# EAGLE design wsd_raspi_shield (EAGLE 6.6.0)
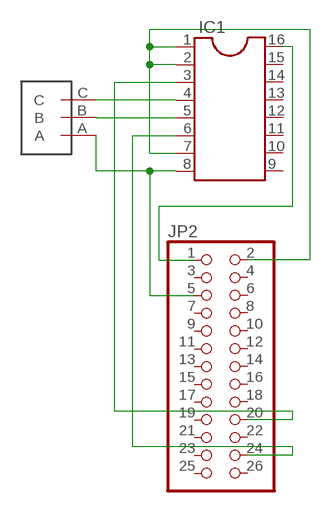
[diagram p0: schematic, sheet 1]

## Parts
IC1  DIL16  [DIL16]
JP2  PINHD-2X13  [2X13]
U$1  TERMINALBLOCK_3P_3.5MM  [TERMINALBLOCK_3P_3.5MM]

## Nets
N$1: IC1.8 JP2.5 U$1.A
N$2: IC1.16 JP2.1
N$3: IC1.3 JP2.20
N$4: IC1.1 IC1.2 IC1.7 JP2.2
N$5: IC1.6 JP2.24
N$6: IC1.5 U$1.B
N$7: IC1.4 U$1.C
Unconnected: IC1.9 IC1.10 IC1.11 IC1.12 IC1.13 IC1.14 IC1.15 JP2.3 JP2.4 JP2.6 JP2.7 JP2.8 JP2.9 JP2.10 JP2.11 JP2.12 JP2.13 JP2.14 JP2.15 JP2.16 JP2.17 JP2.18 JP2.19 JP2.21 JP2.22 JP2.23 JP2.25 JP2.26

## Library data of the parts
IC1 = ic-package:DIL16: Dual In Line / Socket
JP2 = pinhead:PINHD-2X13: PIN HEADER
U$1 = Terminalblock:TERMINALBLOCK_3P_3.5MM

## Board
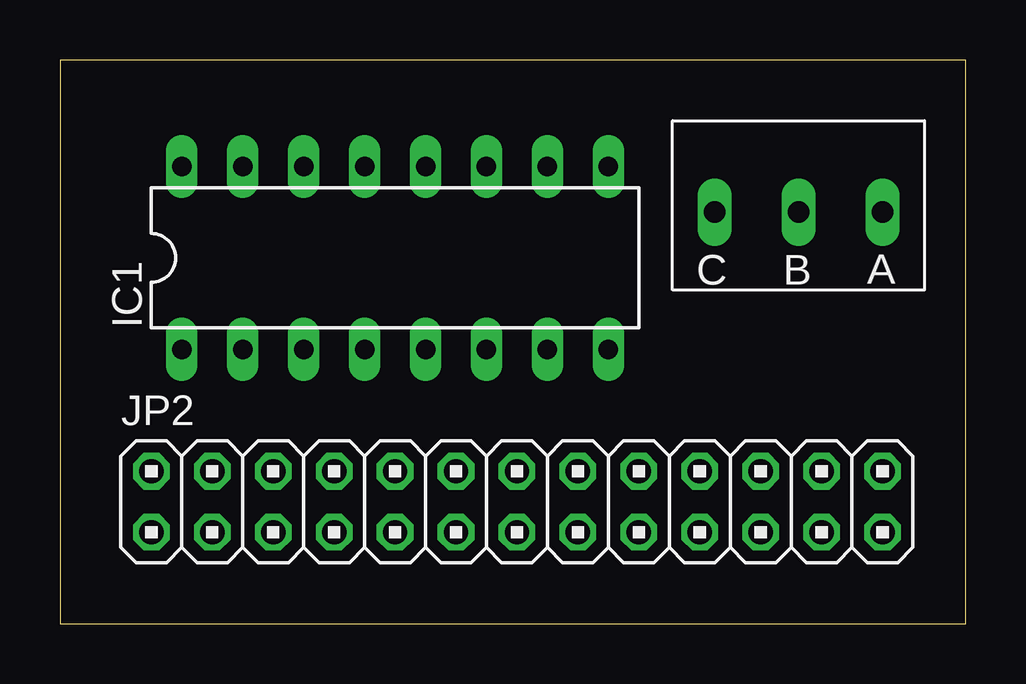
[diagram p1: board, top side]
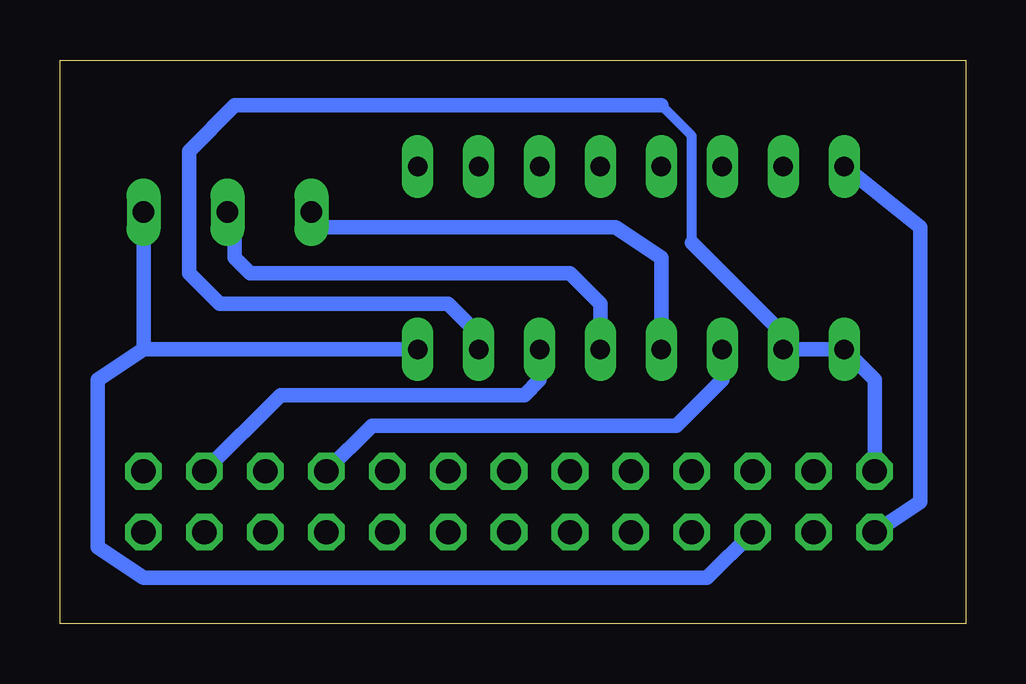
[diagram p2: board, bottom side, seen from below]

Size 37.77 x 23.48 mm. Coordinates in mm from the lower left corner, seen from the top.
Outline: 0,0 37.77,0 37.77,23.48 0,23.48 0,0
Copper layers (1*16): Top 0.035mm / dielectric 1.5mm / Bottom 0.035mm
Design rules "default": minimum track width 10mil, minimum drill 24mil, track to track 8mil, track to pad 8mil, pad to pad 8mil, via to via 8mil, smd to smd 8mil, copper to edge 40mil, drill to drill 8mil, minimum pad ring 10mil, minimum via ring 8mil, stop-mask expansion 4mil, vias tented up to drill 0mil, thermal gap 10mil

### Footprints (pad centres in the part's own frame; a part is rotated, then mirrored left to right if it is on the bottom)
DIL16 = drill 0.813 long: 1 -8.89,-3.81; 2 -6.35,-3.81; 3 -3.81,-3.81; 4 -1.27,-3.81; 5 1.27,-3.81; 6 3.81,-3.81; 7 6.35,-3.81; 8 8.89,-3.81; 9 8.89,3.81; 10 6.35,3.81; 11 3.81,3.81; 12 1.27,3.81; 13 -1.27,3.81; 14 -3.81,3.81; 15 -6.35,3.81; 16 -8.89,3.81
2X13 = drill 1.016 octagon: 1 -15.24,-1.27; 2 -15.24,1.27; 3 -12.7,-1.27; 4 -12.7,1.27; 5 -10.16,-1.27; 6 -10.16,1.27; 7 -7.62,-1.27; 8 -7.62,1.27; 9 -5.08,-1.27; 10 -5.08,1.27; 11 -2.54,-1.27; 12 -2.54,1.27; 13 0,-1.27; 14 0,1.27; 15 2.54,-1.27; 16 2.54,1.27; 17 5.08,-1.27; 18 5.08,1.27; 19 7.62,-1.27; 20 7.62,1.27; 21 10.16,-1.27; 22 10.16,1.27; 23 12.7,-1.27; 24 12.7,1.27; 25 15.24,-1.27; 26 15.24,1.27
TERMINALBLOCK_3P_3.5MM = drill 0.9 long: A 0,0; B 3.5,0; C 7,0

### Placement (x,y rotation side)
IC1  13.97,15.24 0 top
JP2  19.05,5.08 0 top
U$1  34.29,17.14 180 top

### Tracks (layer width: path | path; a pad name or v marks a point on that pad's centre or on a via)
N$1
  Bottom 0.61: IC1.8 34.29,11.43 | JP2.5 10.79,1.91 34.29,1.91 36.2,3.17 36.2,10.16 34.29,11.43 | 34.29,11.43 U$1.A
N$2
  Bottom 0.61: JP2.1 1.91,5.08 1.91,16.51 IC1.16
N$3
  Bottom 0.61: IC1.3 10.16,10.16 12.06,8.26 24.77,8.26 JP2.20
N$4
  Bottom 0.406: IC1.2 7.62,12.06 | 11.43,15.88 11.43,20.32 12.7,21.59 | 20.32,12.06 IC1.7
  Bottom 0.61: JP2.2 3.81,10.16 IC1.1 IC1.2 | 7.62,12.06 11.43,15.88 | 12.7,21.59 30.48,21.59 32.38,19.68 32.38,14.61 31.11,13.33 21.59,13.33 20.32,12.06
N$5
  Bottom 0.61: IC1.6 17.78,10.16 18.41,9.53 28.57,9.53 JP2.24
N$6
  Bottom 0.61: IC1.5 15.24,13.33 16.51,14.61 29.84,14.61 30.48,15.24 30.48,16.2 U$1.B
N$7
  Bottom 0.61: IC1.4 12.7,15.24 14.61,16.51 26.67,16.51 27.29,17.13 U$1.C